# Altium schematic sheet Main Block Diagram.SchDoc
size A; SheetNumber: 1; SheetTotal: 5
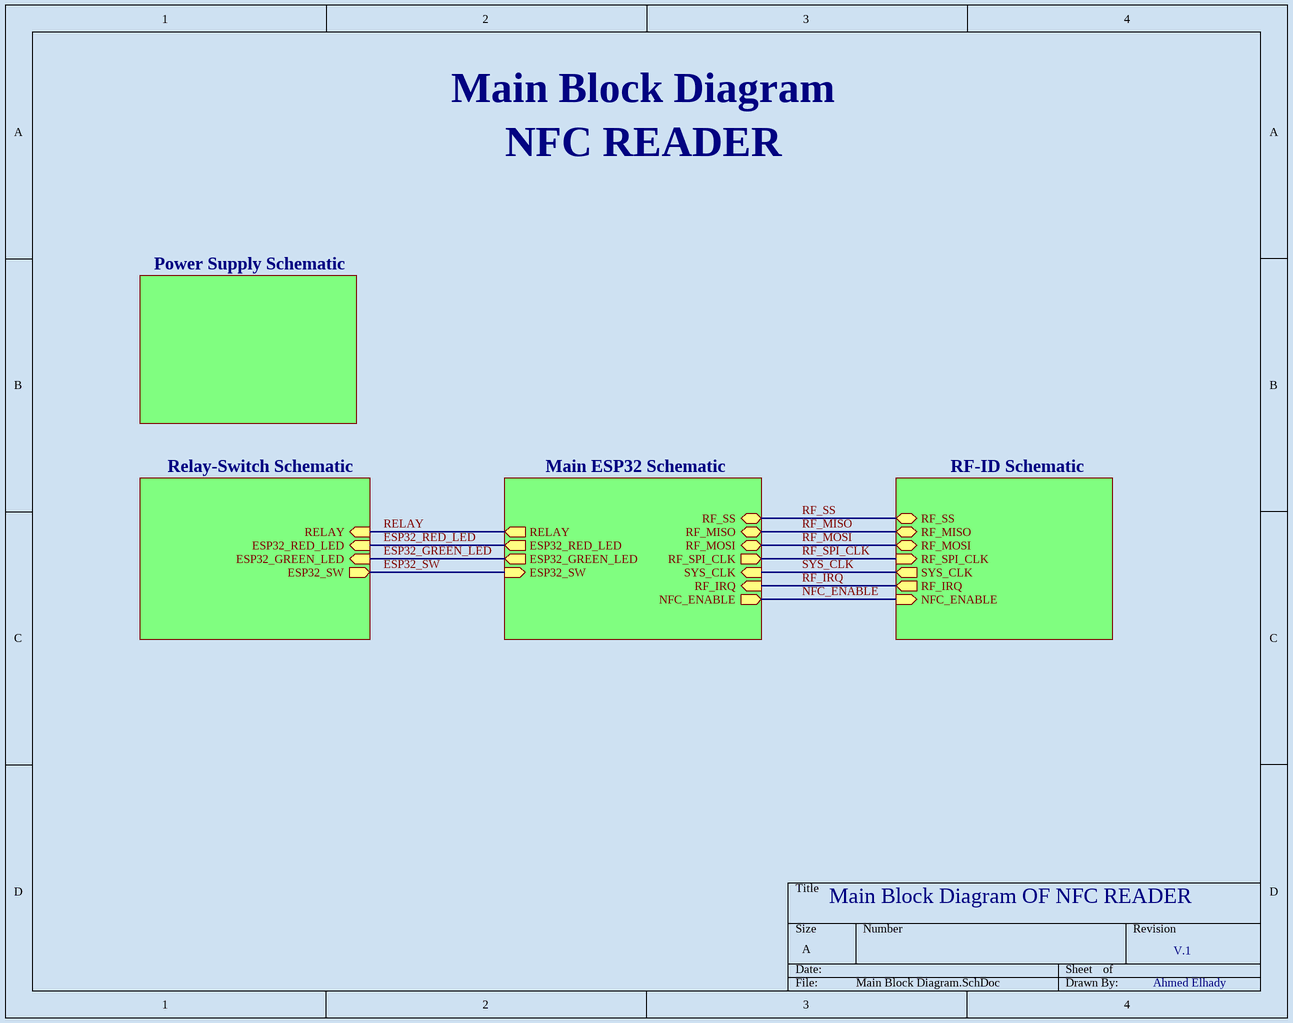
[diagram p0: Main Block Diagram.SchDoc]

## Sub-sheets
Main ESP32 Schematic = ESP32-Main.SchDoc: RF_SS (bidir), RF_MISO (bidir), RF_MOSI (bidir), RF_SPI_CLK (out), SYS_CLK (in), RF_IRQ (in), NFC_ENABLE (out), RELAY (out), ESP32_RED_LED (out), ESP32_GREEN_LED (out), ESP32_SW (in)
Power Supply Schematic = Power Supply.SchDoc: no entries
Relay-Switch Schematic = Relay-Switch.SchDoc: RELAY (in), ESP32_RED_LED (in), ESP32_GREEN_LED (in), ESP32_SW (out)
RF-ID Schematic = RFID-Reader.SchDoc: RF_SS (bidir), RF_MISO (bidir), RF_MOSI (bidir), RF_SPI_CLK (in), SYS_CLK (out), RF_IRQ (out), NFC_ENABLE (in)

## Nets
ESP32_GREEN_LED: sheet Main ESP32 Schematic/ESP32_GREEN_LED, sheet Relay-Switch Schematic/ESP32_GREEN_LED
ESP32_RED_LED: sheet Main ESP32 Schematic/ESP32_RED_LED, sheet Relay-Switch Schematic/ESP32_RED_LED
ESP32_SW: sheet Main ESP32 Schematic/ESP32_SW, sheet Relay-Switch Schematic/ESP32_SW
NFC_ENABLE: sheet Main ESP32 Schematic/NFC_ENABLE, sheet RF-ID Schematic/NFC_ENABLE
RELAY: sheet Main ESP32 Schematic/RELAY, sheet Relay-Switch Schematic/RELAY
RF_IRQ: sheet Main ESP32 Schematic/RF_IRQ, sheet RF-ID Schematic/RF_IRQ
RF_MISO: sheet Main ESP32 Schematic/RF_MISO, sheet RF-ID Schematic/RF_MISO
RF_MOSI: sheet Main ESP32 Schematic/RF_MOSI, sheet RF-ID Schematic/RF_MOSI
RF_SPI_CLK: sheet Main ESP32 Schematic/RF_SPI_CLK, sheet RF-ID Schematic/RF_SPI_CLK
RF_SS: sheet Main ESP32 Schematic/RF_SS, sheet RF-ID Schematic/RF_SS
SYS_CLK: sheet Main ESP32 Schematic/SYS_CLK, sheet RF-ID Schematic/SYS_CLK

## Notes on the sheet
- Main Block Diagram
- NFC READER
- Main Block Diagram OF NFC READER
- V.1
- Ahmed Elhady